# Altium schematic sheet Sense 2 Signal Isolation.SchDoc: Signal 2 Isolator
size 292 x 193 mm; SheetNumber: 4; SheetTotal: 11
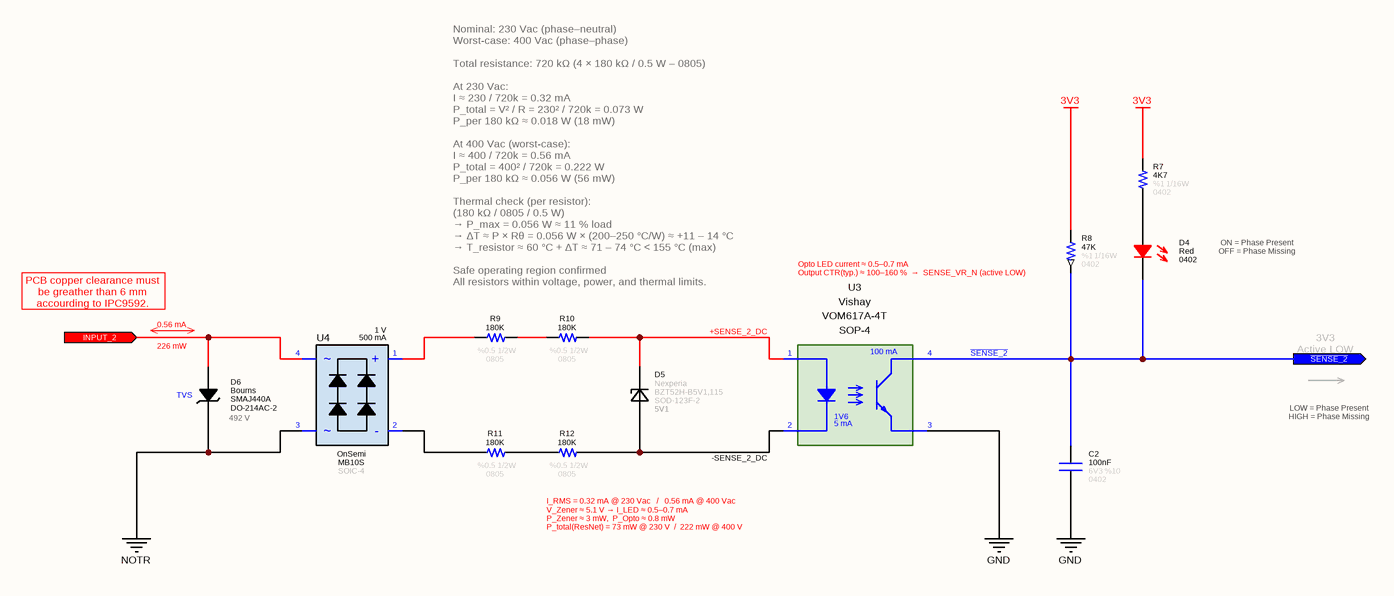
[diagram p0: Sense 2 Signal Isolation.SchDoc]

## Parts
C2  value 100nF  Tolerance: %10  Voltage: 6V3  Case: 0402  [CAPACITOR_0402]  (hidden comment: Capacitor - 100nF [0402] (MLCC))
D4  Case: 0402  Color: Red  [LED_0402]  (hidden comment: SMD LED (Red))
D5  Zener Voltage: 5V1  Manufacturer Name: Nexperia  [SOD-123F-2]  (hidden comment: BZT52H-B5V1,115)
D6  BreakDown Voltage: 492 V  Manufacturer Name: Bourns  Case: DO-214AC-2  [DO-220AA-2]  (hidden comment: SMAJ440A)
R7  value 4K7  Tolerance: %1  Case: 0402  Power: 1/16W  [RESISTOR_0402]  (hidden comment: 4K7 - 0402 - %1 - 1/16W)
R8  value 47K  Tolerance: %1  Case: 0402  Power: 1/16W  [RESISTOR_0402]  (hidden comment: 47K - 0402 - %1 - 1/16W)
R9  value 180K  Tolerance: %0.5  Case: 0805  Power: 1/2W  [RESISTOR_0805]  (hidden comment: 180K - 0805 - %0.5 - 1/2W)
R10  value 180K  Tolerance: %0.5  Case: 0805  Power: 1/2W  [RESISTOR_0805]  (hidden comment: 180K - 0805 - %0.5 - 1/2W)
R11  value 180K  Tolerance: %0.5  Case: 0805  Power: 1/2W  [RESISTOR_0805]  (hidden comment: 180K - 0805 - %0.5 - 1/2W)
R12  value 180K  Tolerance: %0.5  Case: 0805  Power: 1/2W  [RESISTOR_0805]  (hidden comment: 180K - 0805 - %0.5 - 1/2W)
U3  Manufacturer Name: Vishay  Case: SOP-4  If - Forward Current: 5 mA  Vf - Forward Voltage: 1V6  Maximum Collector Current: 100 mA  [SOP-4V2]  (hidden comment: VOM617A-4T)
U4  If - Forward Current: 500 mA  Vf - Forward Voltage: 1 V  Manufacturer Name: OnSemi  Manufacturer Part Number: MB10S  [SOIC-4]  (hidden comment: LTV-846S)

## Ports
INPUT_2 (in), ~{SENSE_2} (out)

## Nets
3V3: R7.2 R8.2
GND: C2.1 U3.3(Emiter)
NOTR: D6.2(Cathode) U4.3
+SENSE_2_DC: D5.1(Cathode) R10.1 U3.1(LED_Anode)
-SENSE_2_DC: D5.2(Anode) R12.1 U3.2(LED_Cathode)
INPUT_2: D6.1(Anode) U4.4 ; port INPUT_2
~{SENSE_2}: C2.2 D4.1 R8.1 U3.4(Collector) ; port ~{SENSE_2}
NetD4_2: D4.2 R7.1
NetR9_1: R9.1 R10.2
NetR9_2: R9.2 U4.1(+)
NetR11_1: R11.1 R12.2
NetR11_2: R11.2 U4.2(-)

## Notes on the sheet
- (near R8) Opto LED current ≈ 0.5–0.7 mA
  Output CTR(typ.) ≈ 100–160 %  →  SENSE_VR_N (active LOW)
- ON = Phase Present
  OFF = Phase Missing
- PCB copper clearance must be greather than 6 mm accourding to IPC9592.
- 0.56 mA
- (near D6) 226 mW
- Nominal: 230 Vac (phase–neutral)
  Worst-case: 400 Vac (phase–phase)
  Total resistance: 720 kΩ (4 × 180 kΩ / 0.5 W – 0805)
  At 230 Vac:
  I ≈ 230 / 720k = 0.32 mA
  P_total = V² / R = 230² / 720k = 0.073 W
  P_per 180 kΩ ≈ 0.018 W (18 mW)
  At 400 Vac (worst-case):
  I ≈ 400 / 720k = 0.56 mA
  P_total = 400² / 720k = 0.222 W
  P_per 180 kΩ ≈ 0.056 W (56 mW)
  Thermal check (per resistor):
  (180 kΩ / 0805 / 0.5 W)
  → P_max = 0.056 W ≈ 11 % load
  → ΔT ≈ P × Rθ = 0.056 W × (200–250 °C/W) ≈ +11 – 14 °C
  → T_resistor ≈ 60 °C + ΔT ≈ 71 – 74 °C < 155 °C (max)
  Safe operating region confirmed
  All resistors within voltage, power, and thermal limits.
- 3V3
  Active LOW
- LOW = Phase Present
  HIGH = Phase Missing
- I_RMS = 0.32 mA @ 230 Vac   /   0.56 mA @ 400 Vac
  V_Zener ≈ 5.1 V → I_LED ≈ 0.5–0.7 mA
  P_Zener ≈ 3 mW,  P_Opto ≈ 0.8 mW
  P_total(ResNet) = 73 mW @ 230 V  /  222 mW @ 400 V
- © 2021 All rights reserved.
  This document may not, in whole or in part, be copied, photocopied, reproduced, translated or converted to any electronic or machine readable from without prior written permission of Mehmet Günce Akkoyun.
  Engineer contact : akkoyun@me.com
- Property of
- Engineer :
- Date :
- Size :
- A4
- Time :
- Project :
- Page :
- /
- Customer :
- Product ID :
- Module ID :
- Version :
- File :
- Revision :
- (in symbol Diode - SMAJ440A (TVS)) TVS

## Library data of the parts
C2 = Capacitor - 100nF [0402-6V3]: Capacitor (MLCC) - 100nF / 6V3 / 0402; Manufacturer Name: KYOCERA AVX; Manufacturer Part Number: 04026D104KAT4A; ComponentLink1Description: Mouser; ComponentLink1URL: https://www.mouser.com.tr/ProductDetail/AVX/04026D104KAT4A?qs=sGAEpiMZZMs0AnBnWHyRQPg4iYkCw7IMED%2F4kpqgf7w%3D; ComponentLink2Description: DataSheet; ComponentLink2URL: https://www.mouser.com.tr/datasheet/2/40/cx5r-776519.pdf; Subcategory: Capacitors
D4 = Diode - LED (0402-Red): Standard LEDs - SMD MINI-MOLD ULTRA COMPACT RED; Manufacturer Name: ROHM Semiconductor; Manufacturer Part Number: SML-P12VTT86R; ROHS: Yes; ComponentLink1Description: DataSheet; ComponentLink1URL: https://www.mouser.com.tr/datasheet/2/348/sml-p1-e-1139198.pdf; ComponentLink2Description: Mouser; ComponentLink2URL: https://www.mouser.com.tr/ProductDetail/ROHM-Semiconductor/SML-P12U2TT86R?qs=sGAEpiMZZMseGfSY3csMkRIBDsfU3UCXJTULB5gem9Ta%252Bp%252BvZ709fg%3D%3D
D5 = Diode - BZT52H-B5V1,115: Zener Diodes BZT52H-B5V1/SOD123F/SOD2; Product Type: Zener Diodes; RoHS: Yes; Manufacturer Part Number: BZT52H-B5V1,115; Case: SOD-123F-2
D6 = Diode - SMAJ440A (TVS): ESD Protection Diodes / TVS Diodes 440volts 1uA .6 Amps Uni-Dir; Peak Pulse Current: 600 mA; Working Voltage: 440 V; Clamping Voltage: 713 V; Product Type: TVS Diodes; RoHS: Yes; Manufacturer Part Number: SMAJ440A
R7 = Resistor - 4K7 [0402]: Thick Film Resistors - SMD 1/16 W 4.7 KOhm 1%; Manufacturer Name: Vishay; Manufacturer Part Number: CRCW04024K70FKED; ComponentLink1Description: DataSheet; ComponentLink1URL: https://www.mouser.com.tr/datasheet/2/427/dcrcwe3-1762152.pdf; ComponentLink2Description: Mouser; ComponentLink2URL: https://www.mouser.com.tr/ProductDetail/Vishay-Dale/CRCW04024K70FKED?qs=sGAEpiMZZMu61qfTUdNhG7nHf%2F6MTUn3HadIdDQu24Q%3D
R8 = Resistor - 47K [0402]: Thick Film Resistors - SMD 1/16 W 47 KOhm 1%; Manufacturer Name: Vishay; Manufacturer Part Number: CRCW040247K0FKED; ComponentLink1Description: DataSheet; ComponentLink1URL: https://www.mouser.com.tr/datasheet/2/427/dcrcwe3-1762152.pdf; ComponentLink2Description: Mouser; ComponentLink2URL: https://www.mouser.com.tr/ProductDetail/Vishay-Dale/CRCW040247K0FKED?qs=sGAEpiMZZMu61qfTUdNhG2DpbjADlD3GL%252B3h1elTxqU%3D
R9-R12 = Resistor - 180K [0805]: Thick Film Resistors - SMD 0805 180Kohms 0.5W 0.5% AEC-Q200; Manufacturer Name: Panasonic; Manufacturer Part Number: ERJ-P06D1803V; ComponentLink1Description: DataSheet; ComponentLink1URL: https://www.mouser.com.tr/datasheet/2/427/dcrcwe3-1762152.pdf; ComponentLink2Description: Mouser; ComponentLink2URL: https://www.mouser.com.tr/ProductDetail/Vishay-Dale/CRCW040210K0FKED?qs=sGAEpiMZZMu61qfTUdNhG2DpbjADlD3GcalbOv9utCY%3D
U3 = IC - VOM617A: Transistor Output Optocouplers Phototransistor Out CTR 160-320% 5mA; RoHS: Yes; Product Type: Transistor Output Optocouplers; Manufacturer Part Number: VOM617A-4T
U4 = IC - MB10S: Transistor Output Optocouplers Optocplr Phototrans 4-Channel; Case: SOIC-4